# Altium schematic sheet 2-MEMORY.SchDoc
size A1; SheetNumber: 2; SheetTotal: 5
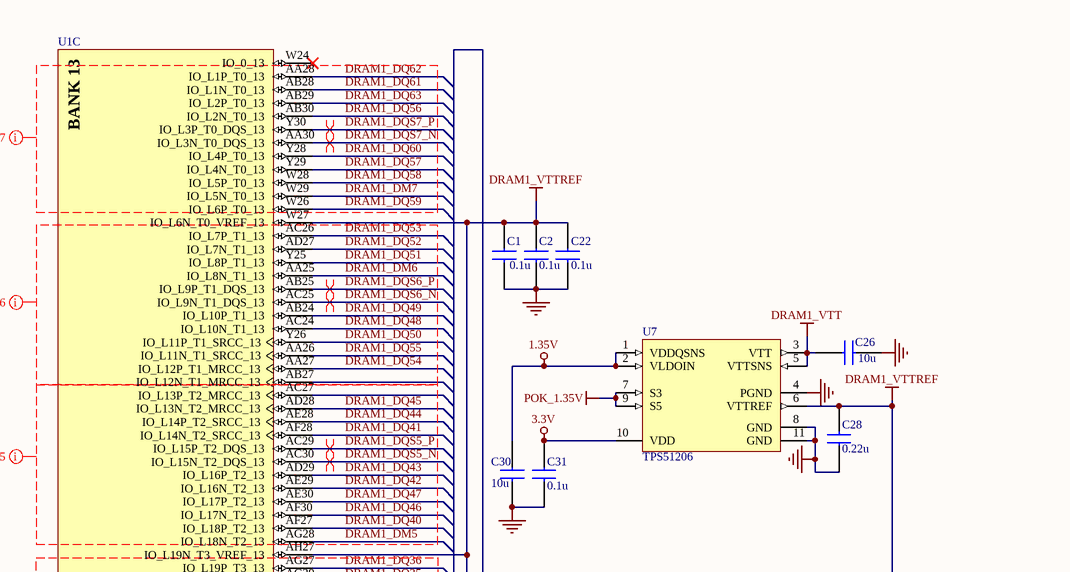
[diagram p0: 2-MEMORY.SchDoc, top left]
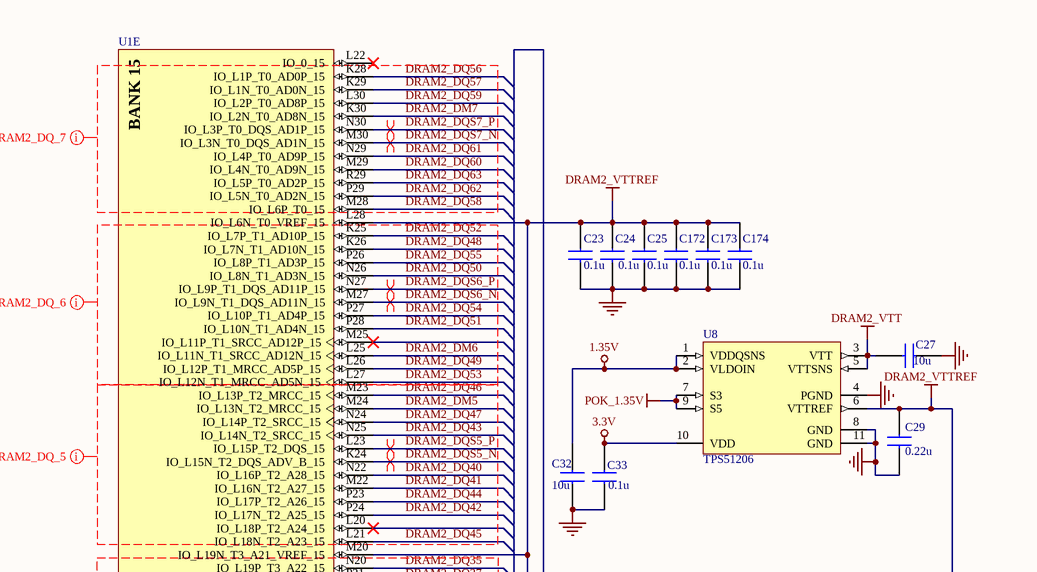
[diagram p1: 2-MEMORY.SchDoc, top right]
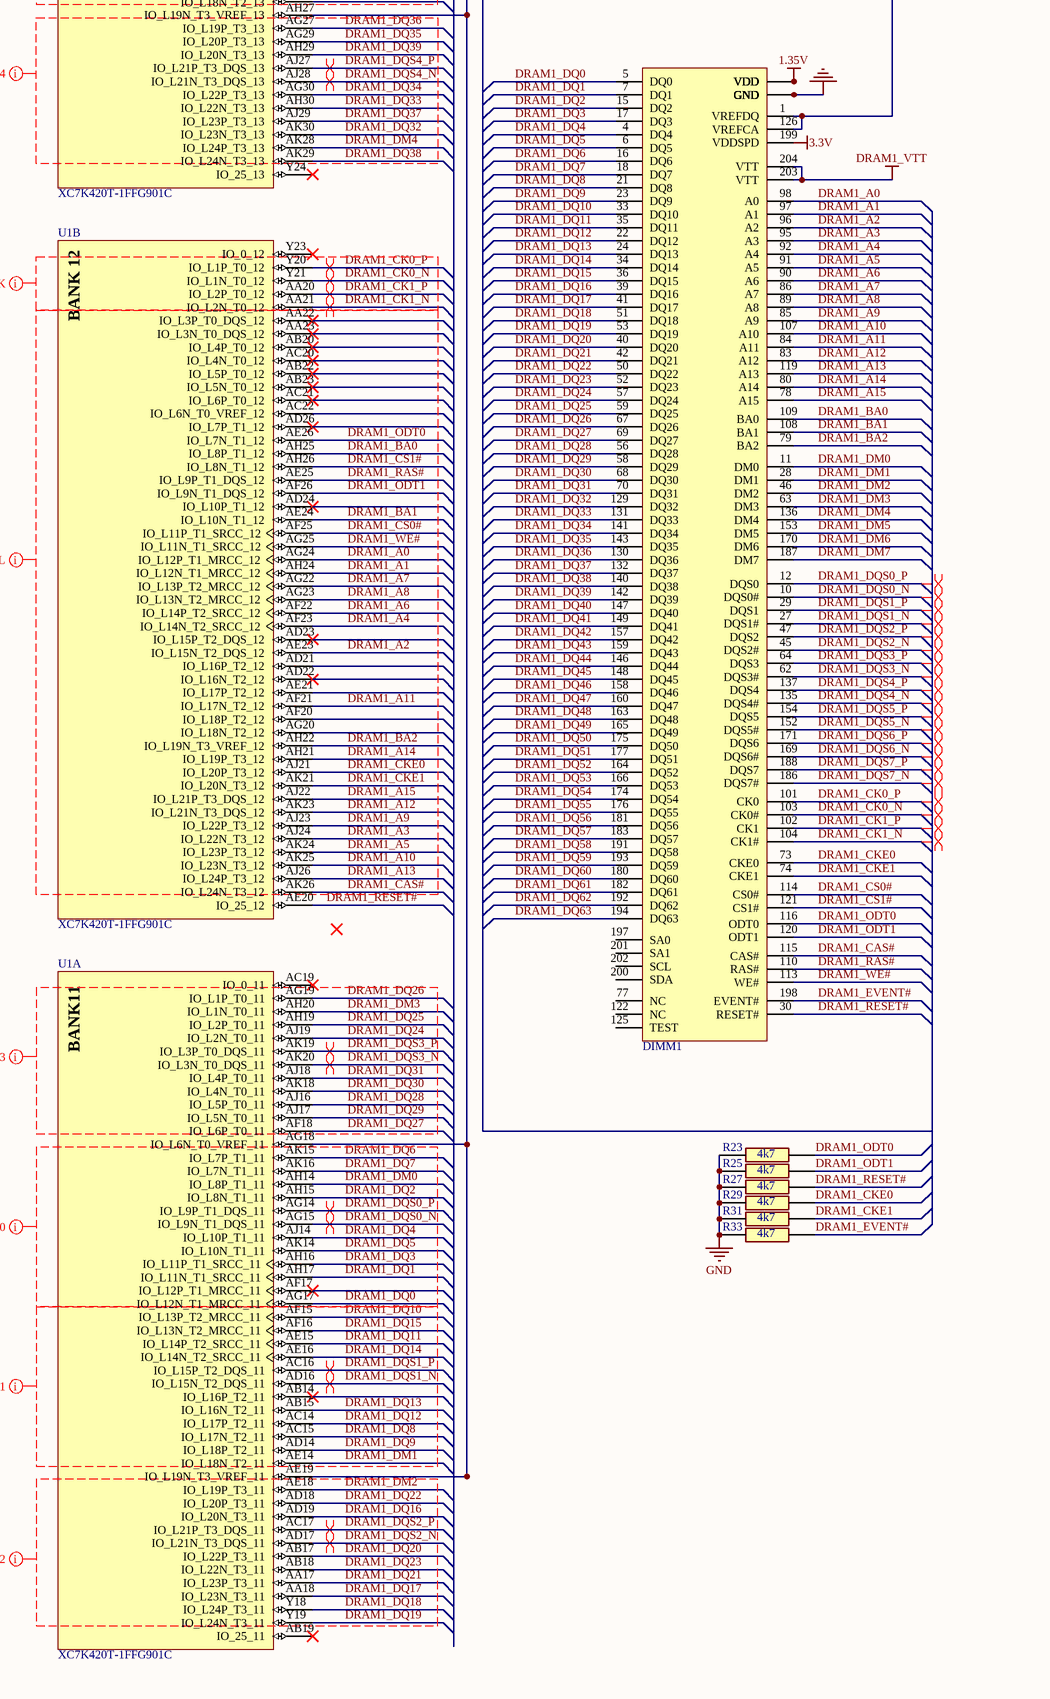
[diagram p2: 2-MEMORY.SchDoc, bottom left]
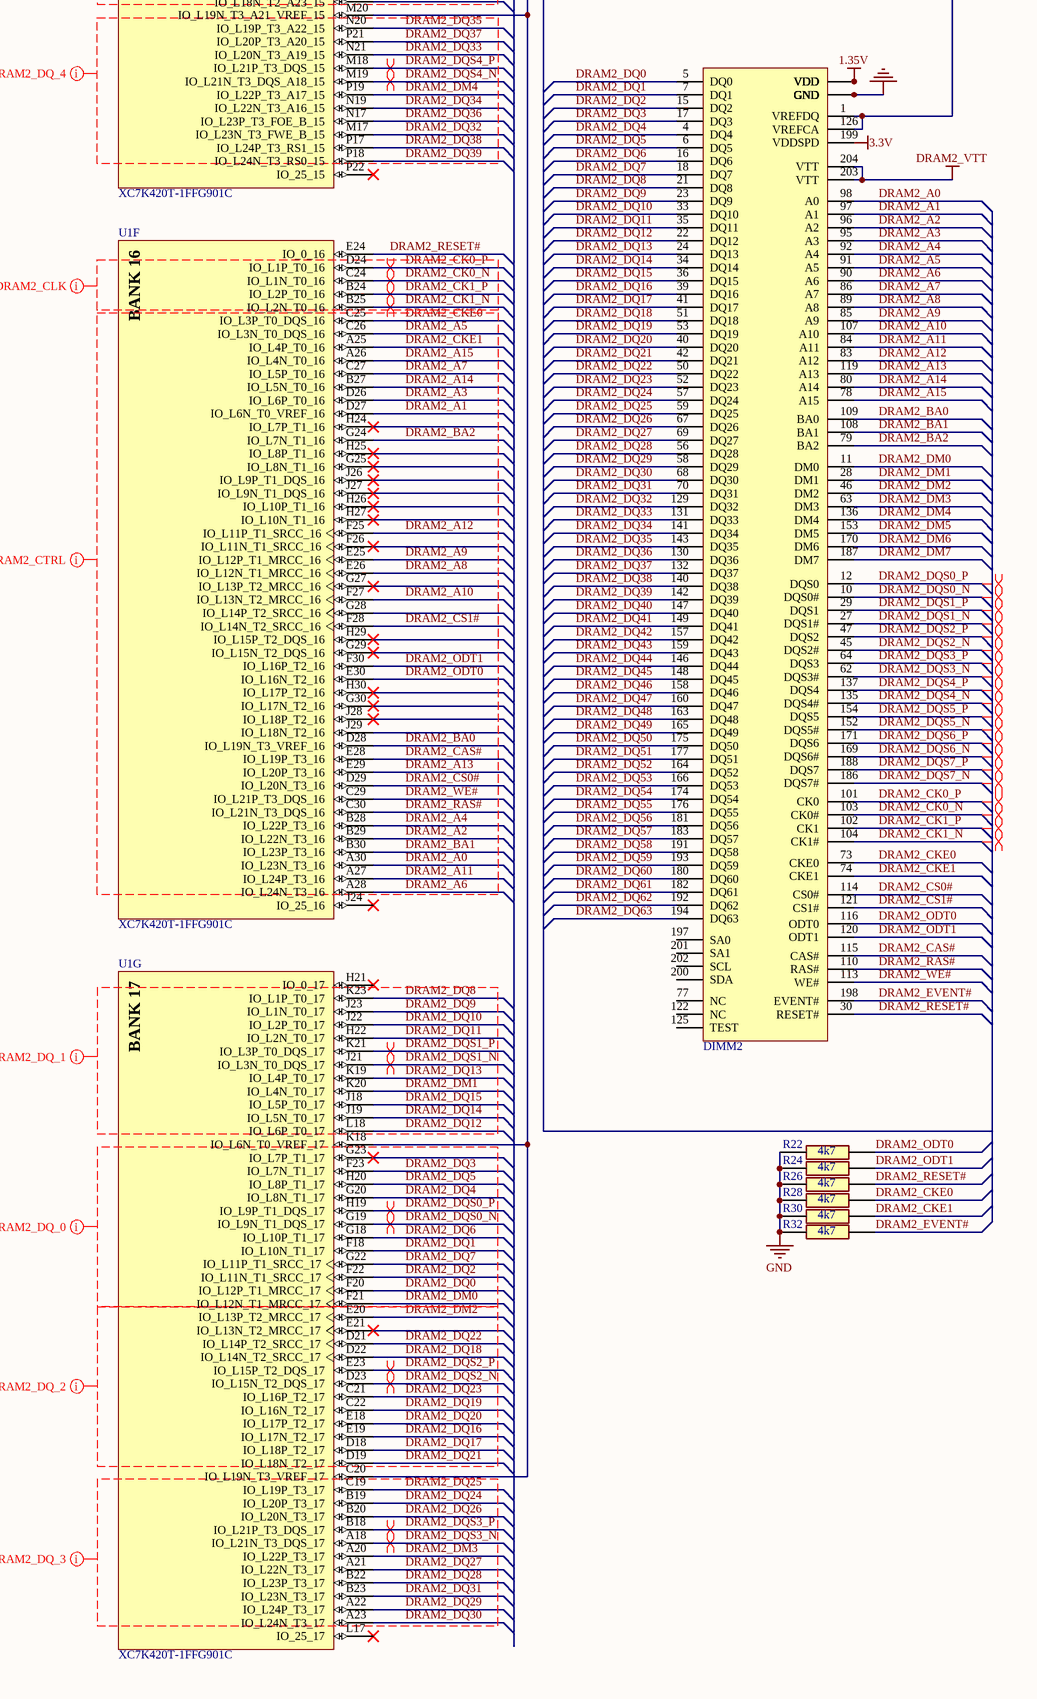
[diagram p3: 2-MEMORY.SchDoc, bottom right]

## Parts
C1  0.1u  [SMD0402]
C2  0.1u  [SMD0402]
C22  0.1u  [SMD0402]
C23  0.1u  [SMD0402]
C24  0.1u  [SMD0402]
C25  0.1u  [SMD0402]
C26  10u  [SMD0402]
C27  10u  [SMD0402]
C28  0.22u  [SMD0402]
C29  0.22u  [SMD0402]
C30  10u  [SMD0402]
C31  0.1u  [SMD0402]
C32  10u  [SMD0402]
C33  0.1u  [SMD0402]
C172  0.1u  [SMD0402]
C173  0.1u  [SMD0402]
C174  0.1u  [SMD0402]
DIMM1  DDR3  [296409204003856]  (value not drawn)
DIMM2  DDR3  [296409204003856]  (value not drawn)
R22  4k7  [SMD0402]
R23  4k7  [SMD0402]
R24  4k7  [SMD0402]
R25  4k7  [SMD0402]
R26  4k7  [SMD0402]
R27  4k7  [SMD0402]
R28  4k7  [SMD0402]
R29  4k7  [SMD0402]
R30  4k7  [SMD0402]
R31  4k7  [SMD0402]
R32  4k7  [SMD0402]
R33  4k7  [SMD0402]
U1  XC7K420T-1FFG901C  [FFG901]  (parts A,B,C,E,F,G of 16)
U7  TPS51206  [SON40P200X200X80-11N]
U8  TPS51206  [SON40P200X200X80-11N]

## Nets
1.35V: C30.1 C32.1 DIMM1.75(VDD) DIMM1.76(VDD) DIMM1.81(VDD) DIMM1.82(VDD) DIMM1.87(VDD) DIMM1.88(VDD) DIMM1.93(VDD) DIMM1.94(VDD) DIMM1.99(VDD) DIMM1.100(VDD) DIMM1.105(VDD) DIMM1.106(VDD) DIMM1.111(VDD) DIMM1.112(VDD) DIMM1.117(VDD) DIMM1.118(VDD) DIMM1.123(VDD) DIMM1.124(VDD) DIMM2.75(VDD) DIMM2.76(VDD) DIMM2.81(VDD) DIMM2.82(VDD) DIMM2.87(VDD) DIMM2.88(VDD) DIMM2.93(VDD) DIMM2.94(VDD) DIMM2.99(VDD) DIMM2.100(VDD) DIMM2.105(VDD) DIMM2.106(VDD) DIMM2.111(VDD) DIMM2.112(VDD) DIMM2.117(VDD) DIMM2.118(VDD) DIMM2.123(VDD) DIMM2.124(VDD) U7.1(VDDQSNS) U7.2(VLDOIN) U8.1(VDDQSNS) U8.2(VLDOIN)
3.3V: C31.1 C33.1 DIMM1.199(VDDSPD) DIMM2.199(VDDSPD) U7.10(VDD) U8.10(VDD)
DRAM1_VTT: C26.1 DIMM1.203(VTT) DIMM1.204(VTT) U7.3(VTT) U7.5(VTTSNS)
DRAM1_VTTREF: C1.2 C2.2 C22.2 C28.2 DIMM1.1(VREFDQ) DIMM1.126(VREFCA) U1.AE19(IO_L19N_T3_VREF_11) U1.AG18(IO_L6N_T0_VREF_11) U1.AH27(IO_L19N_T3_VREF_13) U1.W27(IO_L6N_T0_VREF_13) U7.6(VTTREF)
DRAM2_VTT: C27.1 DIMM2.203(VTT) DIMM2.204(VTT) U8.3(VTT) U8.5(VTTSNS)
DRAM2_VTTREF: C23.2 C24.2 C25.2 C29.2 C172.2 C173.2 C174.2 DIMM2.1(VREFDQ) DIMM2.126(VREFCA) U1.C20(IO_L19N_T3_VREF_17) U1.K18(IO_L6N_T0_VREF_17) U1.L28(IO_L6N_T0_VREF_15) U1.M20(IO_L19N_T3_A21_VREF_15) U8.6(VTTREF)
GND: C1.1 C2.1 C22.1 C23.1 C24.1 C25.1 C26.2 C27.2 C28.1 C29.1 C30.2 C31.2 C32.2 C33.2 C172.1 C173.1 C174.1 DIMM1.2(GND) DIMM1.3(GND) DIMM1.8(GND) DIMM1.9(GND) DIMM1.13(GND) DIMM1.14(GND) DIMM1.19(GND) DIMM1.20(GND) DIMM1.25(GND) DIMM1.26(GND) DIMM1.31(GND) DIMM1.32(GND) DIMM1.37(GND) DIMM1.38(GND) DIMM1.43(GND) DIMM1.44(GND) DIMM1.48(GND) DIMM1.49(GND) DIMM1.54(GND) DIMM1.55(GND) DIMM1.60(GND) DIMM1.61(GND) DIMM1.65(GND) DIMM1.66(GND) DIMM1.71(GND) DIMM1.72(GND) DIMM1.127(GND) DIMM1.128(GND) DIMM1.133(GND) DIMM1.134(GND) DIMM1.138(GND) DIMM1.139(GND) DIMM1.144(GND) DIMM1.145(GND) DIMM1.150(GND) DIMM1.151(GND) DIMM1.155(GND) DIMM1.156(GND) DIMM1.161(GND) DIMM1.162(GND) DIMM1.167(GND) DIMM1.168(GND) DIMM1.172(GND) DIMM1.173(GND) DIMM1.178(GND) DIMM1.179(GND) DIMM1.184(GND) DIMM1.185(GND) DIMM1.189(GND) DIMM1.190(GND) DIMM1.195(GND) DIMM1.196(GND) DIMM2.2(GND) DIMM2.3(GND) DIMM2.8(GND) DIMM2.9(GND) DIMM2.13(GND) DIMM2.14(GND) DIMM2.19(GND) DIMM2.20(GND) DIMM2.25(GND) DIMM2.26(GND) DIMM2.31(GND) DIMM2.32(GND) DIMM2.37(GND) DIMM2.38(GND) DIMM2.43(GND) DIMM2.44(GND) DIMM2.48(GND) DIMM2.49(GND) DIMM2.54(GND) DIMM2.55(GND) DIMM2.60(GND) DIMM2.61(GND) DIMM2.65(GND) DIMM2.66(GND) DIMM2.71(GND) DIMM2.72(GND) DIMM2.127(GND) DIMM2.128(GND) DIMM2.133(GND) DIMM2.134(GND) DIMM2.138(GND) DIMM2.139(GND) DIMM2.144(GND) DIMM2.145(GND) DIMM2.150(GND) DIMM2.151(GND) DIMM2.155(GND) DIMM2.156(GND) DIMM2.161(GND) DIMM2.162(GND) DIMM2.167(GND) DIMM2.168(GND) DIMM2.172(GND) DIMM2.173(GND) DIMM2.178(GND) DIMM2.179(GND) DIMM2.184(GND) DIMM2.185(GND) DIMM2.189(GND) DIMM2.190(GND) DIMM2.195(GND) DIMM2.196(GND) R22.2 R23.2 R24.2 R25.2 R26.2 R27.2 R28.2 R29.2 R30.2 R31.2 R32.2 R33.2 U7.4(PGND) U7.8(GND) U7.11(GND) U8.4(PGND) U8.8(GND) U8.11(GND)
POK_1.35V: U7.7(S3) U7.9(S5) U8.7(S3) U8.9(S5)
DRAM1_A0: DIMM1.98(A0) U1.AG24(IO_L12P_T1_MRCC_12)
DRAM1_A1: DIMM1.97(A1) U1.AH24(IO_L12N_T1_MRCC_12)
DRAM1_A2: DIMM1.96(A2) U1.AE23(IO_L15N_T2_DQS_12)
DRAM1_A3: DIMM1.95(A3) U1.AJ24(IO_L22N_T3_12)
DRAM1_A4: DIMM1.92(A4) U1.AF23(IO_L14N_T2_SRCC_12)
DRAM1_A5: DIMM1.91(A5) U1.AK24(IO_L23P_T3_12)
DRAM1_A6: DIMM1.90(A6) U1.AF22(IO_L14P_T2_SRCC_12)
DRAM1_A7: DIMM1.86(A7) U1.AG22(IO_L13P_T2_MRCC_12)
DRAM1_A8: DIMM1.89(A8) U1.AG23(IO_L13N_T2_MRCC_12)
DRAM1_A9: DIMM1.85(A9) U1.AJ23(IO_L22P_T3_12)
DRAM1_A10: DIMM1.107(A10) U1.AK25(IO_L23N_T3_12)
DRAM1_A11: DIMM1.84(A11) U1.AF21(IO_L17N_T2_12)
DRAM1_A12: DIMM1.83(A12) U1.AK23(IO_L21N_T3_DQS_12)
DRAM1_A13: DIMM1.119(A13) U1.AJ26(IO_L24P_T3_12)
DRAM1_A14: DIMM1.80(A14) U1.AH21(IO_L19P_T3_12)
DRAM1_A15: DIMM1.78(A15) U1.AJ22(IO_L21P_T3_DQS_12)
DRAM1_BA0: DIMM1.109(BA0) U1.AH25(IO_L8P_T1_12)
DRAM1_BA1: DIMM1.108(BA1) U1.AE24(IO_L10N_T1_12)
DRAM1_BA2: DIMM1.79(BA2) U1.AH22(IO_L19N_T3_VREF_12)
DRAM1_CAS#: DIMM1.115(CAS#) U1.AK26(IO_L24N_T3_12)
DRAM1_CK0_N: DIMM1.103(CK0#) U1.Y21(IO_L1N_T0_12)
DRAM1_CK0_P: DIMM1.101(CK0) U1.Y20(IO_L1P_T0_12)
DRAM1_CK1_N: DIMM1.104(CK1#) U1.AA21(IO_L2N_T0_12)
DRAM1_CK1_P: DIMM1.102(CK1) U1.AA20(IO_L2P_T0_12)
DRAM1_CKE0: DIMM1.73(CKE0) R29.1 U1.AJ21(IO_L20P_T3_12)
DRAM1_CKE1: DIMM1.74(CKE1) R31.1 U1.AK21(IO_L20N_T3_12)
DRAM1_CS0#: DIMM1.114(CS0#) U1.AF25(IO_L11P_T1_SRCC_12)
DRAM1_CS1#: DIMM1.121(CS1#) U1.AH26(IO_L8N_T1_12)
DRAM1_DM0: DIMM1.11(DM0) U1.AH14(IO_L8P_T1_11)
DRAM1_DM1: DIMM1.28(DM1) U1.AE14(IO_L18N_T2_11)
DRAM1_DM2: DIMM1.46(DM2) U1.AE18(IO_L19P_T3_11)
DRAM1_DM3: DIMM1.63(DM3) U1.AH20(IO_L1N_T0_11)
DRAM1_DM4: DIMM1.136(DM4) U1.AK28(IO_L24P_T3_13)
DRAM1_DM5: DIMM1.153(DM5) U1.AG28(IO_L18N_T2_13)
DRAM1_DM6: DIMM1.170(DM6) U1.AA25(IO_L8N_T1_13)
DRAM1_DM7: DIMM1.187(DM7) U1.W29(IO_L5N_T0_13)
DRAM1_DQ0: DIMM1.5(DQ0) U1.AG17(IO_L12N_T1_MRCC_11)
DRAM1_DQ1: DIMM1.7(DQ1) U1.AH17(IO_L11N_T1_SRCC_11)
DRAM1_DQ2: DIMM1.15(DQ2) U1.AH15(IO_L8N_T1_11)
DRAM1_DQ3: DIMM1.17(DQ3) U1.AH16(IO_L11P_T1_SRCC_11)
DRAM1_DQ4: DIMM1.4(DQ4) U1.AJ14(IO_L10P_T1_11)
DRAM1_DQ5: DIMM1.6(DQ5) U1.AK14(IO_L10N_T1_11)
DRAM1_DQ6: DIMM1.16(DQ6) U1.AK15(IO_L7P_T1_11)
DRAM1_DQ7: DIMM1.18(DQ7) U1.AK16(IO_L7N_T1_11)
DRAM1_DQ8: DIMM1.21(DQ8) U1.AC15(IO_L17N_T2_11)
DRAM1_DQ9: DIMM1.23(DQ9) U1.AD14(IO_L18P_T2_11)
DRAM1_DQ10: DIMM1.33(DQ10) U1.AF15(IO_L13P_T2_MRCC_11)
DRAM1_DQ11: DIMM1.35(DQ11) U1.AE15(IO_L14P_T2_SRCC_11)
DRAM1_DQ12: DIMM1.22(DQ12) U1.AC14(IO_L17P_T2_11)
DRAM1_DQ13: DIMM1.24(DQ13) U1.AB15(IO_L16N_T2_11)
DRAM1_DQ14: DIMM1.34(DQ14) U1.AE16(IO_L14N_T2_SRCC_11)
DRAM1_DQ15: DIMM1.36(DQ15) U1.AF16(IO_L13N_T2_MRCC_11)
DRAM1_DQ16: DIMM1.39(DQ16) U1.AD19(IO_L20N_T3_11)
DRAM1_DQ17: DIMM1.41(DQ17) U1.AA18(IO_L23N_T3_11)
DRAM1_DQ18: DIMM1.51(DQ18) U1.Y18(IO_L24P_T3_11)
DRAM1_DQ19: DIMM1.53(DQ19) U1.Y19(IO_L24N_T3_11)
DRAM1_DQ20: DIMM1.40(DQ20) U1.AB17(IO_L22P_T3_11)
DRAM1_DQ21: DIMM1.42(DQ21) U1.AA17(IO_L23P_T3_11)
DRAM1_DQ22: DIMM1.50(DQ22) U1.AD18(IO_L20P_T3_11)
DRAM1_DQ23: DIMM1.52(DQ23) U1.AB18(IO_L22N_T3_11)
DRAM1_DQ24: DIMM1.57(DQ24) U1.AJ19(IO_L2N_T0_11)
DRAM1_DQ25: DIMM1.59(DQ25) U1.AH19(IO_L2P_T0_11)
DRAM1_DQ26: DIMM1.67(DQ26) U1.AG19(IO_L1P_T0_11)
DRAM1_DQ27: DIMM1.69(DQ27) U1.AF18(IO_L6P_T0_11)
DRAM1_DQ28: DIMM1.56(DQ28) U1.AJ16(IO_L5P_T0_11)
DRAM1_DQ29: DIMM1.58(DQ29) U1.AJ17(IO_L5N_T0_11)
DRAM1_DQ30: DIMM1.68(DQ30) U1.AK18(IO_L4N_T0_11)
DRAM1_DQ31: DIMM1.70(DQ31) U1.AJ18(IO_L4P_T0_11)
DRAM1_DQ32: DIMM1.129(DQ32) U1.AK30(IO_L23N_T3_13)
DRAM1_DQ33: DIMM1.131(DQ33) U1.AH30(IO_L22N_T3_13)
DRAM1_DQ34: DIMM1.141(DQ34) U1.AG30(IO_L22P_T3_13)
DRAM1_DQ35: DIMM1.143(DQ35) U1.AG29(IO_L20P_T3_13)
DRAM1_DQ36: DIMM1.130(DQ36) U1.AG27(IO_L19P_T3_13)
DRAM1_DQ37: DIMM1.132(DQ37) U1.AJ29(IO_L23P_T3_13)
DRAM1_DQ38: DIMM1.140(DQ38) U1.AK29(IO_L24N_T3_13)
DRAM1_DQ39: DIMM1.142(DQ39) U1.AH29(IO_L20N_T3_13)
DRAM1_DQ40: DIMM1.147(DQ40) U1.AF27(IO_L18P_T2_13)
DRAM1_DQ41: DIMM1.149(DQ41) U1.AF28(IO_L14N_T2_SRCC_13)
DRAM1_DQ42: DIMM1.157(DQ42) U1.AE29(IO_L16N_T2_13)
DRAM1_DQ43: DIMM1.159(DQ43) U1.AD29(IO_L16P_T2_13)
DRAM1_DQ44: DIMM1.146(DQ44) U1.AE28(IO_L14P_T2_SRCC_13)
DRAM1_DQ45: DIMM1.148(DQ45) U1.AD28(IO_L13N_T2_MRCC_13)
DRAM1_DQ46: DIMM1.158(DQ46) U1.AF30(IO_L17N_T2_13)
DRAM1_DQ47: DIMM1.160(DQ47) U1.AE30(IO_L17P_T2_13)
DRAM1_DQ48: DIMM1.163(DQ48) U1.AC24(IO_L10N_T1_13)
DRAM1_DQ49: DIMM1.165(DQ49) U1.AB24(IO_L10P_T1_13)
DRAM1_DQ50: DIMM1.175(DQ50) U1.Y26(IO_L11P_T1_SRCC_13)
DRAM1_DQ51: DIMM1.177(DQ51) U1.Y25(IO_L8P_T1_13)
DRAM1_DQ52: DIMM1.164(DQ52) U1.AD27(IO_L7N_T1_13)
DRAM1_DQ53: DIMM1.166(DQ53) U1.AC26(IO_L7P_T1_13)
DRAM1_DQ54: DIMM1.174(DQ54) U1.AA27(IO_L12P_T1_MRCC_13)
DRAM1_DQ55: DIMM1.176(DQ55) U1.AA26(IO_L11N_T1_SRCC_13)
DRAM1_DQ56: DIMM1.181(DQ56) U1.AB30(IO_L2N_T0_13)
DRAM1_DQ57: DIMM1.183(DQ57) U1.Y29(IO_L4N_T0_13)
DRAM1_DQ58: DIMM1.191(DQ58) U1.W28(IO_L5P_T0_13)
DRAM1_DQ59: DIMM1.193(DQ59) U1.W26(IO_L6P_T0_13)
DRAM1_DQ60: DIMM1.180(DQ60) U1.Y28(IO_L4P_T0_13)
DRAM1_DQ61: DIMM1.182(DQ61) U1.AB28(IO_L1N_T0_13)
DRAM1_DQ62: DIMM1.192(DQ62) U1.AA28(IO_L1P_T0_13)
DRAM1_DQ63: DIMM1.194(DQ63) U1.AB29(IO_L2P_T0_13)
DRAM1_DQS0_N: DIMM1.10(DQS0#) U1.AG15(IO_L9N_T1_DQS_11)
DRAM1_DQS0_P: DIMM1.12(DQS0) U1.AG14(IO_L9P_T1_DQS_11)
DRAM1_DQS1_N: DIMM1.27(DQS1#) U1.AD16(IO_L15N_T2_DQS_11)
DRAM1_DQS1_P: DIMM1.29(DQS1) U1.AC16(IO_L15P_T2_DQS_11)
DRAM1_DQS2_N: DIMM1.45(DQS2#) U1.AD17(IO_L21N_T3_DQS_11)
DRAM1_DQS2_P: DIMM1.47(DQS2) U1.AC17(IO_L21P_T3_DQS_11)
DRAM1_DQS3_N: DIMM1.62(DQS3#) U1.AK20(IO_L3N_T0_DQS_11)
DRAM1_DQS3_P: DIMM1.64(DQS3) U1.AK19(IO_L3P_T0_DQS_11)
DRAM1_DQS4_N: DIMM1.135(DQS4#) U1.AJ28(IO_L21N_T3_DQS_13)
DRAM1_DQS4_P: DIMM1.137(DQS4) U1.AJ27(IO_L21P_T3_DQS_13)
DRAM1_DQS5_N: DIMM1.152(DQS5#) U1.AC30(IO_L15N_T2_DQS_13)
DRAM1_DQS5_P: DIMM1.154(DQS5) U1.AC29(IO_L15P_T2_DQS_13)
DRAM1_DQS6_N: DIMM1.169(DQS6#) U1.AC25(IO_L9N_T1_DQS_13)
DRAM1_DQS6_P: DIMM1.171(DQS6) U1.AB25(IO_L9P_T1_DQS_13)
DRAM1_DQS7_N: DIMM1.186(DQS7#) U1.AA30(IO_L3N_T0_DQS_13)
DRAM1_DQS7_P: DIMM1.188(DQS7) U1.Y30(IO_L3P_T0_DQS_13)
DRAM1_EVENT#: DIMM1.198(EVENT#) R33.1
DRAM1_ODT0: DIMM1.116(ODT0) R23.1 U1.AE26(IO_L7N_T1_12)
DRAM1_ODT1: DIMM1.120(ODT1) R25.1 U1.AF26(IO_L9N_T1_DQS_12)
DRAM1_RAS#: DIMM1.110(RAS#) U1.AE25(IO_L9P_T1_DQS_12)
DRAM1_RESET#: DIMM1.30(RESET#) R27.1 U1.AE20(IO_25_12)
DRAM1_WE#: DIMM1.113(WE#) U1.AG25(IO_L11N_T1_SRCC_12)
DRAM2_A0: DIMM2.98(A0) U1.A30(IO_L23N_T3_16)
DRAM2_A1: DIMM2.97(A1) U1.D27(IO_L6N_T0_VREF_16)
DRAM2_A2: DIMM2.96(A2) U1.B29(IO_L22N_T3_16)
DRAM2_A3: DIMM2.95(A3) U1.D26(IO_L6P_T0_16)
DRAM2_A4: DIMM2.92(A4) U1.B28(IO_L22P_T3_16)
DRAM2_A5: DIMM2.91(A5) U1.C26(IO_L3N_T0_DQS_16)
DRAM2_A6: DIMM2.90(A6) U1.A28(IO_L24N_T3_16)
DRAM2_A7: DIMM2.86(A7) U1.C27(IO_L5P_T0_16)
DRAM2_A8: DIMM2.89(A8) U1.E26(IO_L12N_T1_MRCC_16)
DRAM2_A9: DIMM2.85(A9) U1.E25(IO_L12P_T1_MRCC_16)
DRAM2_A10: DIMM2.107(A10) U1.F27(IO_L13N_T2_MRCC_16)
DRAM2_A11: DIMM2.84(A11) U1.A27(IO_L24P_T3_16)
DRAM2_A12: DIMM2.83(A12) U1.F25(IO_L11P_T1_SRCC_16)
DRAM2_A13: DIMM2.119(A13) U1.E29(IO_L20P_T3_16)
DRAM2_A14: DIMM2.80(A14) U1.B27(IO_L5N_T0_16)
DRAM2_A15: DIMM2.78(A15) U1.A26(IO_L4N_T0_16)
DRAM2_BA0: DIMM2.109(BA0) U1.D28(IO_L19N_T3_VREF_16)
DRAM2_BA1: DIMM2.108(BA1) U1.B30(IO_L23P_T3_16)
DRAM2_BA2: DIMM2.79(BA2) U1.G24(IO_L7N_T1_16)
DRAM2_CAS#: DIMM2.115(CAS#) U1.E28(IO_L19P_T3_16)
DRAM2_CK0_N: DIMM2.103(CK0#) U1.C24(IO_L1N_T0_16)
DRAM2_CK0_P: DIMM2.101(CK0) U1.D24(IO_L1P_T0_16)
DRAM2_CK1_N: DIMM2.104(CK1#) U1.B25(IO_L2N_T0_16)
DRAM2_CK1_P: DIMM2.102(CK1) U1.B24(IO_L2P_T0_16)
DRAM2_CKE0: DIMM2.73(CKE0) R28.1 U1.C25(IO_L3P_T0_DQS_16)
DRAM2_CKE1: DIMM2.74(CKE1) R30.1 U1.A25(IO_L4P_T0_16)
DRAM2_CS0#: DIMM2.114(CS0#) U1.D29(IO_L20N_T3_16)
DRAM2_CS1#: DIMM2.121(CS1#) U1.F28(IO_L14N_T2_SRCC_16)
DRAM2_DM0: DIMM2.11(DM0) U1.F21(IO_L12N_T1_MRCC_17)
DRAM2_DM1: DIMM2.28(DM1) U1.K20(IO_L4N_T0_17)
DRAM2_DM2: DIMM2.46(DM2) U1.E20(IO_L13P_T2_MRCC_17)
DRAM2_DM3: DIMM2.63(DM3) U1.A20(IO_L22P_T3_17)
DRAM2_DM4: DIMM2.136(DM4) U1.P19(IO_L22P_T3_A17_15)
DRAM2_DM5: DIMM2.153(DM5) U1.M24(IO_L13N_T2_MRCC_15)
DRAM2_DM6: DIMM2.170(DM6) U1.L25(IO_L11N_T1_SRCC_AD12N_15)
DRAM2_DM7: DIMM2.187(DM7) U1.K30(IO_L2N_T0_AD8N_15)
DRAM2_DQ0: DIMM2.5(DQ0) U1.F20(IO_L12P_T1_MRCC_17)
DRAM2_DQ1: DIMM2.7(DQ1) U1.F18(IO_L10N_T1_17)
DRAM2_DQ2: DIMM2.15(DQ2) U1.F22(IO_L11N_T1_SRCC_17)
DRAM2_DQ3: DIMM2.17(DQ3) U1.F23(IO_L7N_T1_17)
DRAM2_DQ4: DIMM2.4(DQ4) U1.G20(IO_L8N_T1_17)
DRAM2_DQ5: DIMM2.6(DQ5) U1.H20(IO_L8P_T1_17)
DRAM2_DQ6: DIMM2.16(DQ6) U1.G18(IO_L10P_T1_17)
DRAM2_DQ7: DIMM2.18(DQ7) U1.G22(IO_L11P_T1_SRCC_17)
DRAM2_DQ8: DIMM2.21(DQ8) U1.K23(IO_L1P_T0_17)
DRAM2_DQ9: DIMM2.23(DQ9) U1.J23(IO_L1N_T0_17)
DRAM2_DQ10: DIMM2.33(DQ10) U1.J22(IO_L2P_T0_17)
DRAM2_DQ11: DIMM2.35(DQ11) U1.H22(IO_L2N_T0_17)
DRAM2_DQ12: DIMM2.22(DQ12) U1.L18(IO_L6P_T0_17)
DRAM2_DQ13: DIMM2.24(DQ13) U1.K19(IO_L4P_T0_17)
DRAM2_DQ14: DIMM2.34(DQ14) U1.J19(IO_L5N_T0_17)
DRAM2_DQ15: DIMM2.36(DQ15) U1.J18(IO_L5P_T0_17)
DRAM2_DQ16: DIMM2.39(DQ16) U1.E19(IO_L17N_T2_17)
DRAM2_DQ17: DIMM2.41(DQ17) U1.D18(IO_L18P_T2_17)
DRAM2_DQ18: DIMM2.51(DQ18) U1.D22(IO_L14N_T2_SRCC_17)
DRAM2_DQ19: DIMM2.53(DQ19) U1.C22(IO_L16N_T2_17)
DRAM2_DQ20: DIMM2.40(DQ20) U1.E18(IO_L17P_T2_17)
DRAM2_DQ21: DIMM2.42(DQ21) U1.D19(IO_L18N_T2_17)
DRAM2_DQ22: DIMM2.50(DQ22) U1.D21(IO_L14P_T2_SRCC_17)
DRAM2_DQ23: DIMM2.52(DQ23) U1.C21(IO_L16P_T2_17)
DRAM2_DQ24: DIMM2.57(DQ24) U1.B19(IO_L20P_T3_17)
DRAM2_DQ25: DIMM2.59(DQ25) U1.C19(IO_L19P_T3_17)
DRAM2_DQ26: DIMM2.67(DQ26) U1.B20(IO_L20N_T3_17)
DRAM2_DQ27: DIMM2.69(DQ27) U1.A21(IO_L22N_T3_17)
DRAM2_DQ28: DIMM2.56(DQ28) U1.B22(IO_L23P_T3_17)
DRAM2_DQ29: DIMM2.58(DQ29) U1.A22(IO_L24P_T3_17)
DRAM2_DQ30: DIMM2.68(DQ30) U1.A23(IO_L24N_T3_17)
DRAM2_DQ31: DIMM2.70(DQ31) U1.B23(IO_L23N_T3_17)
DRAM2_DQ32: DIMM2.129(DQ32) U1.M17(IO_L23N_T3_FWE_B_15)
DRAM2_DQ33: DIMM2.131(DQ33) U1.N21(IO_L20N_T3_A19_15)
DRAM2_DQ34: DIMM2.141(DQ34) U1.N19(IO_L22N_T3_A16_15)
DRAM2_DQ35: DIMM2.143(DQ35) U1.N20(IO_L19P_T3_A22_15)
DRAM2_DQ36: DIMM2.130(DQ36) U1.N17(IO_L23P_T3_FOE_B_15)
DRAM2_DQ37: DIMM2.132(DQ37) U1.P21(IO_L20P_T3_A20_15)
DRAM2_DQ38: DIMM2.140(DQ38) U1.P17(IO_L24P_T3_RS1_15)
DRAM2_DQ39: DIMM2.142(DQ39) U1.P18(IO_L24N_T3_RS0_15)
DRAM2_DQ40: DIMM2.147(DQ40) U1.N22(IO_L16P_T2_A28_15)
DRAM2_DQ41: DIMM2.149(DQ41) U1.M22(IO_L16N_T2_A27_15)
DRAM2_DQ42: DIMM2.157(DQ42) U1.P24(IO_L17N_T2_A25_15)
DRAM2_DQ43: DIMM2.159(DQ43) U1.N25(IO_L14N_T2_SRCC_15)
DRAM2_DQ44: DIMM2.146(DQ44) U1.P23(IO_L17P_T2_A26_15)
DRAM2_DQ45: DIMM2.148(DQ45) U1.L21(IO_L18N_T2_A23_15)
DRAM2_DQ46: DIMM2.158(DQ46) U1.M23(IO_L13P_T2_MRCC_15)
DRAM2_DQ47: DIMM2.160(DQ47) U1.N24(IO_L14P_T2_SRCC_15)
DRAM2_DQ48: DIMM2.163(DQ48) U1.K26(IO_L7N_T1_AD10N_15)
DRAM2_DQ49: DIMM2.165(DQ49) U1.L26(IO_L12P_T1_MRCC_AD5P_15)
DRAM2_DQ50: DIMM2.175(DQ50) U1.N26(IO_L8N_T1_AD3N_15)
DRAM2_DQ51: DIMM2.177(DQ51) U1.P28(IO_L10N_T1_AD4N_15)
DRAM2_DQ52: DIMM2.164(DQ52) U1.K25(IO_L7P_T1_AD10P_15)
DRAM2_DQ53: DIMM2.166(DQ53) U1.L27(IO_L12N_T1_MRCC_AD5N_15)
DRAM2_DQ54: DIMM2.174(DQ54) U1.P27(IO_L10P_T1_AD4P_15)
DRAM2_DQ55: DIMM2.176(DQ55) U1.P26(IO_L8P_T1_AD3P_15)
DRAM2_DQ56: DIMM2.181(DQ56) U1.K28(IO_L1P_T0_AD0P_15)
DRAM2_DQ57: DIMM2.183(DQ57) U1.K29(IO_L1N_T0_AD0N_15)
DRAM2_DQ58: DIMM2.191(DQ58) U1.M28(IO_L6P_T0_15)
DRAM2_DQ59: DIMM2.193(DQ59) U1.L30(IO_L2P_T0_AD8P_15)
DRAM2_DQ60: DIMM2.180(DQ60) U1.M29(IO_L4N_T0_AD9N_15)
DRAM2_DQ61: DIMM2.182(DQ61) U1.N29(IO_L4P_T0_AD9P_15)
DRAM2_DQ62: DIMM2.192(DQ62) U1.P29(IO_L5N_T0_AD2N_15)
DRAM2_DQ63: DIMM2.194(DQ63) U1.R29(IO_L5P_T0_AD2P_15)
DRAM2_DQS0_N: DIMM2.10(DQS0#) U1.G19(IO_L9N_T1_DQS_17)
DRAM2_DQS0_P: DIMM2.12(DQS0) U1.H19(IO_L9P_T1_DQS_17)
DRAM2_DQS1_N: DIMM2.27(DQS1#) U1.J21(IO_L3N_T0_DQS_17)
DRAM2_DQS1_P: DIMM2.29(DQS1) U1.K21(IO_L3P_T0_DQS_17)
DRAM2_DQS2_N: DIMM2.45(DQS2#) U1.D23(IO_L15N_T2_DQS_17)
DRAM2_DQS2_P: DIMM2.47(DQS2) U1.E23(IO_L15P_T2_DQS_17)
DRAM2_DQS3_N: DIMM2.62(DQS3#) U1.A18(IO_L21N_T3_DQS_17)
DRAM2_DQS3_P: DIMM2.64(DQS3) U1.B18(IO_L21P_T3_DQS_17)
DRAM2_DQS4_N: DIMM2.135(DQS4#) U1.M19(IO_L21N_T3_DQS_A18_15)
DRAM2_DQS4_P: DIMM2.137(DQS4) U1.M18(IO_L21P_T3_DQS_15)
DRAM2_DQS5_N: DIMM2.152(DQS5#) U1.K24(IO_L15N_T2_DQS_ADV_B_15)
DRAM2_DQS5_P: DIMM2.154(DQS5) U1.L23(IO_L15P_T2_DQS_15)
DRAM2_DQS6_N: DIMM2.169(DQS6#) U1.M27(IO_L9N_T1_DQS_AD11N_15)
DRAM2_DQS6_P: DIMM2.171(DQS6) U1.N27(IO_L9P_T1_DQS_AD11P_15)
DRAM2_DQS7_N: DIMM2.186(DQS7#) U1.M30(IO_L3N_T0_DQS_AD1N_15)
DRAM2_DQS7_P: DIMM2.188(DQS7) U1.N30(IO_L3P_T0_DQS_AD1P_15)
DRAM2_EVENT#: DIMM2.198(EVENT#) R32.1
DRAM2_ODT0: DIMM2.116(ODT0) R22.1 U1.E30(IO_L16N_T2_16)
DRAM2_ODT1: DIMM2.120(ODT1) R24.1 U1.F30(IO_L16P_T2_16)
DRAM2_RAS#: DIMM2.110(RAS#) U1.C30(IO_L21N_T3_DQS_16)
DRAM2_RESET#: DIMM2.30(RESET#) R26.1 U1.E24(IO_0_16)
DRAM2_WE#: DIMM2.113(WE#) U1.C29(IO_L21P_T3_DQS_16)

Not connected (* = marked no-connect by the designer): DIMM1 77(NC) 122(NC) 125(TEST) 197(SA0) 200(SDA) 201(SA1) 202(SCL); DIMM2 77(NC) 122(NC) 125(TEST) 197(SA0) 200(SDA) 201(SA1) 202(SCL); U1 AA22(IO_L3P_T0_DQS_12)* AA23(IO_L3N_T0_DQS_12)* AB14(IO_L16P_T2_11)* AB19(IO_25_11)* AB20(IO_L4P_T0_12)* AB22(IO_L5P_T0_12)* AB23(IO_L5N_T0_12)* AB27(IO_L12N_T1_MRCC_13) AC19(IO_0_11)* AC20(IO_L4N_T0_12)* AC21(IO_L6P_T0_12)* AC22(IO_L6N_T0_VREF_12) AC27(IO_L13P_T2_MRCC_13) AD21(IO_L16P_T2_12) AD22(IO_L16N_T2_12)* AD23(IO_L15P_T2_DQS_12)* AD24(IO_L10P_T1_12)* AD26(IO_L7P_T1_12)* AE21(IO_L17P_T2_12) AF17(IO_L12P_T1_MRCC_11)* AF20(IO_L18P_T2_12) AG20(IO_L18N_T2_12) E21(IO_L13N_T2_MRCC_17)* F26(IO_L11N_T1_SRCC_16)* G23(IO_L7P_T1_17)* G25(IO_L8N_T1_16)* G27(IO_L13P_T2_MRCC_16)* G28(IO_L14P_T2_SRCC_16) G29(IO_L15N_T2_DQS_16)* G30(IO_L17N_T2_16)* H21(IO_0_17)* H24(IO_L7P_T1_16)* H25(IO_L8P_T1_16)* H26(IO_L10P_T1_16)* H27(IO_L10N_T1_16)* H29(IO_L15P_T2_DQS_16)* H30(IO_L17P_T2_16)* J24(IO_25_16)* J26(IO_L9P_T1_DQS_16)* J27(IO_L9N_T1_DQS_16)* J28(IO_L18P_T2_16)* J29(IO_L18N_T2_16) L17(IO_25_17)* L20(IO_L18P_T2_A24_15)* L22(IO_0_15)* M25(IO_L11P_T1_SRCC_AD12P_15)* P22(IO_25_15)* W24(IO_0_13)* Y23(IO_0_12)* Y24(IO_25_13)*

## Layout directives
differential pair; differential pair class DRAM1_DIF: DRAM1_CK0_N, DRAM1_CK0_P, DRAM1_CK1_N, DRAM1_CK1_P, DRAM1_DQS0_N, DRAM1_DQS0_P, DRAM1_DQS1_N, DRAM1_DQS1_P, DRAM1_DQS2_N, DRAM1_DQS2_P, DRAM1_DQS3_N, DRAM1_DQS3_P, DRAM1_DQS4_N, DRAM1_DQS4_P, DRAM1_DQS5_N, DRAM1_DQS5_P, DRAM1_DQS6_N, DRAM1_DQS6_P, DRAM1_DQS7_N, DRAM1_DQS7_P
differential pair; differential pair class DRAM2_DIF: DRAM2_CK0_N, DRAM2_CK0_P, DRAM2_CK1_N, DRAM2_CK1_P, DRAM2_DQS0_N, DRAM2_DQS0_P, DRAM2_DQS1_N, DRAM2_DQS1_P, DRAM2_DQS2_N, DRAM2_DQS2_P, DRAM2_DQS3_N, DRAM2_DQS3_P, DRAM2_DQS4_N, DRAM2_DQS4_P, DRAM2_DQS5_N, DRAM2_DQS5_P, DRAM2_DQS6_N, DRAM2_DQS6_P, DRAM2_DQS7_N, DRAM2_DQS7_P
differential pair; differential pair class DRAM1_DQS_7: DRAM1_DQS7_N, DRAM1_DQS7_P
differential pair; differential pair class DRAM1_DQS_6: DRAM1_DQS6_N, DRAM1_DQS6_P
differential pair; differential pair class DRAM1_DQS_5: DRAM1_DQS5_N, DRAM1_DQS5_P
differential pair; differential pair class DRAM1_DQS_4: DRAM1_DQS4_N, DRAM1_DQS4_P
differential pair; differential pair class DRAM1_DQS_3: DRAM1_DQS3_N, DRAM1_DQS3_P
differential pair; differential pair class DRAM1_DQS_0: DRAM1_DQS0_N, DRAM1_DQS0_P
differential pair; differential pair class DRAM1_DQS_1: DRAM1_DQS1_N, DRAM1_DQS1_P
differential pair; differential pair class DRAM1_DQS_2: DRAM1_DQS2_N, DRAM1_DQS2_P
differential pair; differential pair class DRAM1_CLK: DRAM1_CK0_N, DRAM1_CK0_P, DRAM1_CK1_N, DRAM1_CK1_P
net class DRAM1_DQ_7: DRAM1_DM7, DRAM1_DQ56, DRAM1_DQ57, DRAM1_DQ58, DRAM1_DQ59, DRAM1_DQ60, DRAM1_DQ61, DRAM1_DQ62, DRAM1_DQ63, DRAM1_DQS7_N, DRAM1_DQS7_P
net class DRAM1_DQ_6: DRAM1_DM6, DRAM1_DQ48, DRAM1_DQ49, DRAM1_DQ50, DRAM1_DQ51, DRAM1_DQ52, DRAM1_DQ53, DRAM1_DQ54, DRAM1_DQ55, DRAM1_DQS6_N, DRAM1_DQS6_P
net class DRAM1_DQ_5: DRAM1_DM5, DRAM1_DQ40, DRAM1_DQ41, DRAM1_DQ42, DRAM1_DQ43, DRAM1_DQ44, DRAM1_DQ45, DRAM1_DQ46, DRAM1_DQ47, DRAM1_DQS5_N, DRAM1_DQS5_P
net class DRAM1_DQ_4: DRAM1_DM4, DRAM1_DQ32, DRAM1_DQ33, DRAM1_DQ34, DRAM1_DQ35, DRAM1_DQ36, DRAM1_DQ37, DRAM1_DQ38, DRAM1_DQ39, DRAM1_DQS4_N, DRAM1_DQS4_P
net class DRAM1_CTRL: DRAM1_A0, DRAM1_A1, DRAM1_A2, DRAM1_A3, DRAM1_A4, DRAM1_A5, DRAM1_A6, DRAM1_A7, DRAM1_A8, DRAM1_A9, DRAM1_A10, DRAM1_A11, DRAM1_A12, DRAM1_A13, DRAM1_A14, DRAM1_A15, DRAM1_BA0, DRAM1_BA1, DRAM1_BA2, DRAM1_CAS#, DRAM1_CKE0, DRAM1_CKE1, DRAM1_CS0#, DRAM1_CS1#, DRAM1_ODT0, DRAM1_ODT1, DRAM1_RAS#, DRAM1_WE#
net class DRAM1_DQ_3: DRAM1_DM3, DRAM1_DQ24, DRAM1_DQ25, DRAM1_DQ26, DRAM1_DQ27, DRAM1_DQ28, DRAM1_DQ29, DRAM1_DQ30, DRAM1_DQ31, DRAM1_DQS3_N, DRAM1_DQS3_P
net class DRAM1_DQ_0: DRAM1_DM0, DRAM1_DQ0, DRAM1_DQ1, DRAM1_DQ2, DRAM1_DQ3, DRAM1_DQ4, DRAM1_DQ5, DRAM1_DQ6, DRAM1_DQ7, DRAM1_DQS0_N, DRAM1_DQS0_P
net class DRAM1_DQ_1: DRAM1_DM1, DRAM1_DQ8, DRAM1_DQ9, DRAM1_DQ10, DRAM1_DQ11, DRAM1_DQ12, DRAM1_DQ13, DRAM1_DQ14, DRAM1_DQ15, DRAM1_DQS1_N, DRAM1_DQS1_P
net class DRAM1_DQ_2: DRAM1_DM2, DRAM1_DQ16, DRAM1_DQ17, DRAM1_DQ18, DRAM1_DQ19, DRAM1_DQ20, DRAM1_DQ21, DRAM1_DQ22, DRAM1_DQ23, DRAM1_DQS2_N, DRAM1_DQS2_P
differential pair; differential pair class DRAM2_DQS_7: DRAM2_DQS7_N, DRAM2_DQS7_P
differential pair; differential pair class DRAM2_DQS_6: DRAM2_DQS6_N, DRAM2_DQS6_P
differential pair; differential pair class DRAM2_DQS_5: DRAM2_DQS5_N, DRAM2_DQS5_P
differential pair; differential pair class DRAM2_DQS_4: DRAM2_DQS4_N, DRAM2_DQS4_P
differential pair; differential pair class DRAM2_DQS_1: DRAM2_DQS1_N, DRAM2_DQS1_P
differential pair; differential pair class DRAM2_DQS_0: DRAM2_DQS0_N, DRAM2_DQS0_P
differential pair; differential pair class DRAM2_DQS_2: DRAM2_DQS2_N, DRAM2_DQS2_P
differential pair; differential pair class DRAM2_DQS_3: DRAM2_DQS3_N, DRAM2_DQS3_P
differential pair; differential pair class DRAM2_CLK: DRAM2_CK0_N, DRAM2_CK0_P, DRAM2_CK1_N, DRAM2_CK1_P
net class DRAM2_DQ_7: DRAM2_DM7, DRAM2_DQ56, DRAM2_DQ57, DRAM2_DQ58, DRAM2_DQ59, DRAM2_DQ60, DRAM2_DQ61, DRAM2_DQ62, DRAM2_DQ63, DRAM2_DQS7_N, DRAM2_DQS7_P
net class DRAM2_DQ_6: DRAM2_DM6, DRAM2_DQ48, DRAM2_DQ49, DRAM2_DQ50, DRAM2_DQ51, DRAM2_DQ52, DRAM2_DQ53, DRAM2_DQ54, DRAM2_DQ55, DRAM2_DQS6_N, DRAM2_DQS6_P
net class DRAM2_DQ_5: DRAM2_DM5, DRAM2_DQ40, DRAM2_DQ41, DRAM2_DQ42, DRAM2_DQ43, DRAM2_DQ44, DRAM2_DQ45, DRAM2_DQ46, DRAM2_DQ47, DRAM2_DQS5_N, DRAM2_DQS5_P
net class DRAM2_DQ_4: DRAM2_DM4, DRAM2_DQ32, DRAM2_DQ33, DRAM2_DQ34, DRAM2_DQ35, DRAM2_DQ36, DRAM2_DQ37, DRAM2_DQ38, DRAM2_DQ39, DRAM2_DQS4_N, DRAM2_DQS4_P
net class DRAM2_CTRL: DRAM2_A0, DRAM2_A1, DRAM2_A2, DRAM2_A3, DRAM2_A4, DRAM2_A5, DRAM2_A6, DRAM2_A7, DRAM2_A8, DRAM2_A9, DRAM2_A10, DRAM2_A11, DRAM2_A12, DRAM2_A13, DRAM2_A14, DRAM2_A15, DRAM2_BA0, DRAM2_BA1, DRAM2_BA2, DRAM2_CAS#, DRAM2_CKE0, DRAM2_CKE1, DRAM2_CS0#, DRAM2_CS1#, DRAM2_ODT0, DRAM2_ODT1, DRAM2_RAS#, DRAM2_WE#
net class DRAM2_DQ_1: DRAM2_DM1, DRAM2_DQ8, DRAM2_DQ9, DRAM2_DQ10, DRAM2_DQ11, DRAM2_DQ12, DRAM2_DQ13, DRAM2_DQ14, DRAM2_DQ15, DRAM2_DQS1_N, DRAM2_DQS1_P
net class DRAM2_DQ_0: DRAM2_DM0, DRAM2_DQ0, DRAM2_DQ1, DRAM2_DQ2, DRAM2_DQ3, DRAM2_DQ4, DRAM2_DQ5, DRAM2_DQ6, DRAM2_DQ7, DRAM2_DQS0_N, DRAM2_DQS0_P
net class DRAM2_DQ_2: DRAM2_DM2, DRAM2_DQ16, DRAM2_DQ17, DRAM2_DQ18, DRAM2_DQ19, DRAM2_DQ20, DRAM2_DQ21, DRAM2_DQ22, DRAM2_DQ23, DRAM2_DQS2_N, DRAM2_DQS2_P
net class DRAM2_DQ_3: DRAM2_DM3, DRAM2_DQ24, DRAM2_DQ25, DRAM2_DQ26, DRAM2_DQ27, DRAM2_DQ28, DRAM2_DQ29, DRAM2_DQ30, DRAM2_DQ31, DRAM2_DQS3_N, DRAM2_DQS3_P
net class DRAM1_CLK: DRAM1_CK0_N, DRAM1_CK0_P, DRAM1_CK1_N, DRAM1_CK1_P
net class DRAM2_CLK: DRAM2_CK0_N, DRAM2_CK0_P, DRAM2_CK1_N, DRAM2_CK1_P

## Notes on the sheet
- (in symbol XC7K420T-1FFG901C, part A) BANK11
- (in symbol XC7K420T-1FFG901C, part B) BANK 12
- (in symbol XC7K420T-1FFG901C, part C) BANK 13
- (in symbol XC7K420T-1FFG901C, part E) BANK 15
- (in symbol XC7K420T-1FFG901C, part F) BANK 16
- (in symbol XC7K420T-1FFG901C, part G) BANK 17

## Library data of the parts
C1 C2 C22-C33 C172-C174 = CAP 0402: Capacitor
DIMM1 DIMM2 = DIMM-204P: Kyocera 296409204003856+
R22-R33 = RES 0402: Resistor
U1 = XC7K420T-1FFG901C: Kintex-7 FPGA, 400 User I/Os, 28 GTX, 900-Ball BGA, Speed Grade 1, Commercial Grade, Pb-Free; Manufacturer: Xilinx; GTX: 28; SelectIO HP: 0; SelectIO HR: 380; Speed Grade: -1; DatasheetVersion: v1.12; PackageVersion: Rev 1.8; PackageReference: FFG901; PackageDescription: Flip-Chip BGA, Body 31 x 31 mm, 1.0 mm Pitch; Generic Part Number: XC7K420T; RoHS: Pb-Free; Mounting Technology: Surface Mount; Code_JEDEC: MS-034-AAN-1; PartNumber: XC7K420T-1FFG901C; ComponentLink1Description: Datasheet; ComponentLink1URL: http://www.xilinx.com/support/documentation/data_sheets/ds180_7Series_Overview.pdf; ComponentLink2Description: Package Specification; ComponentLink2URL: http://www.xilinx.com/support/documentation/user_guides/ug475_7Series_Pkg_Pinout.pdf